# Altium project OBATS.PrjPcb
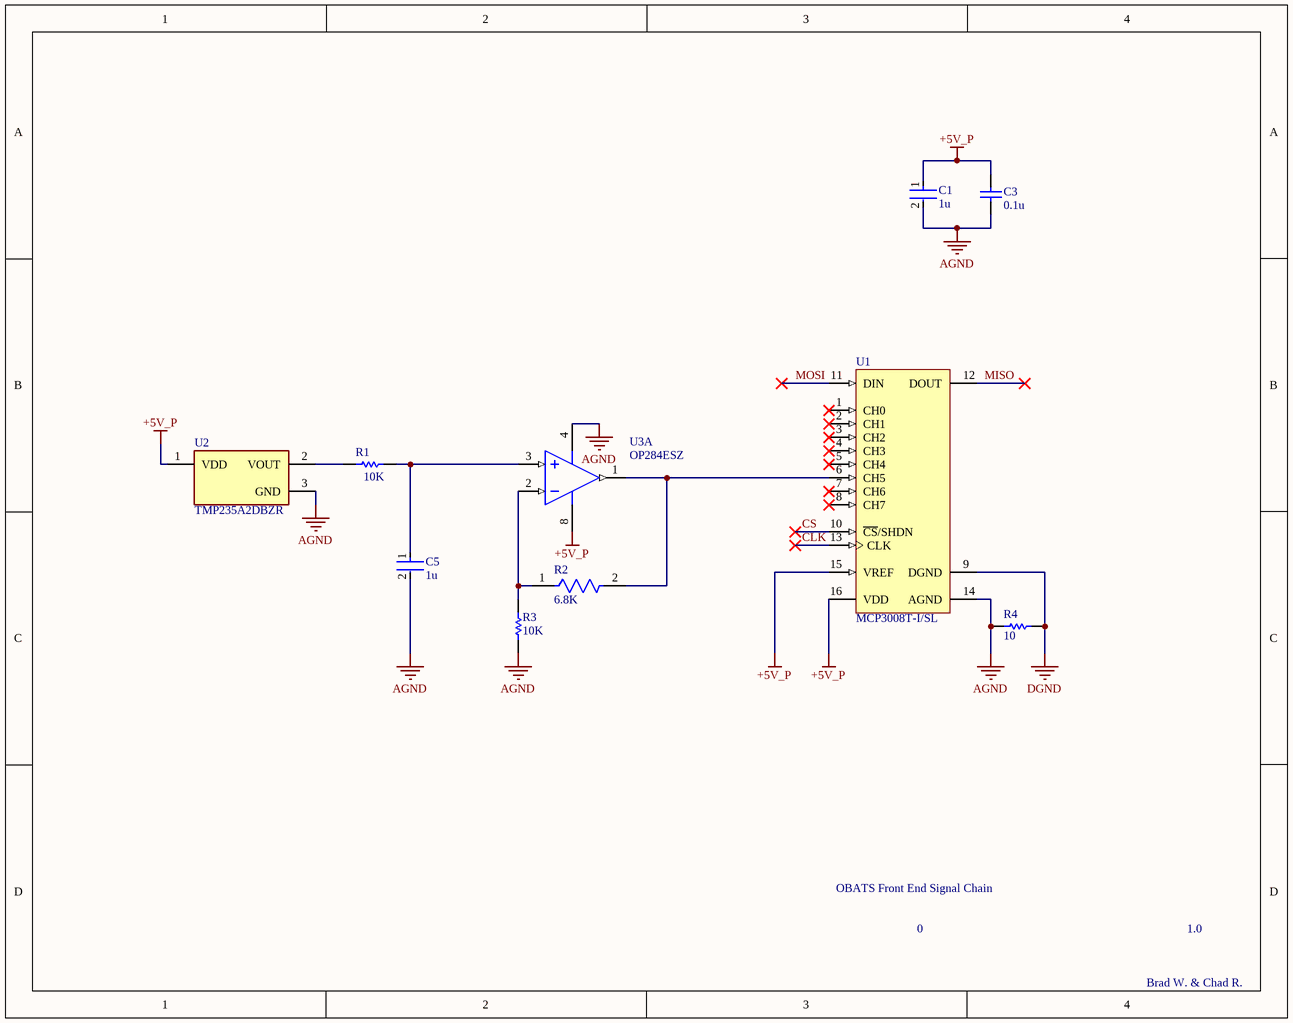
[diagram p0: tmp235_Front_End_Siognal_Chain.SchDoc]
1 sheet, 10 parts. Net scope: global (net labels, ports and power ports of the same name join across sheets).
Board file: tmp235_Front_End_Siognal_Chain.PcbDoc

## Sheet tmp235_Front_End_Siognal_Chain.SchDoc
size A

### Parts
C1  1u  [FP-CL31-IPC_B]
C3  0.1u  [CAPC1206(3216)130_M]
C5  1u  [FP-CL31-IPC_B]
R1  10K  [RESC3116X65X45ML10T20]
R2  6.8K  [FP-AC1206-MFG]
R3  10K  [RESC3116X65X45ML10T20]
R4  10  [RESC3216X60X45ML10T20]
U1  MCP3008T-I/SL  [SOIC-SL16_N]
U2  TMP235A2DBZR  [FP-DBZ0003A-MFG]
U3  OP284ESZ  [ADI-R-8_L]  (part A of 2)

### Nets
+5V_P: C1.1 C3.2 U1.15(VREF) U1.16(VDD) U2.1(VDD) U3.8(+V)
AGND: C1.2 C3.1 C5.2 R3.1 R4.1 U1.14(AGND) U2.3(GND) U3.4(-V)
DGND: R4.2 U1.9(DGND)
CLK: U1.13(CLK)
CS: U1.10(~{CS}/SHDN)
MISO: U1.12(DOUT)
MOSI: U1.11(DIN)
NetC5_1: C5.1 R1.2 U3.3(+IN_A)
NetR1_1: R1.1 U2.2(VOUT)
NetR2_1: R2.1 R3.2 U3.2(-IN_A)
NetR2_2: R2.2 U1.6(CH5) U3.1(OUT_A)

Not connected (* = marked no-connect by the designer): U1 1(CH0)* 2(CH1)* 3(CH2)* 4(CH3)* 5(CH4)* 7(CH6)* 8(CH7)*

### Notes on the sheet
- OBATS Front End Signal Chain
- 0
- 1.0
- Brad W. & Chad R.

### Library data of the parts
C1 C5 = CMP-13271-001662-1: Cap Ceramic 1uF 50V X7R ±10% SMD 1206 +125°C Embossed T/R; Case Code (Metric): 3216; Packaging: Tape and Reel; Depth: 1.6mm; Max Operating Temperature: 125°C; Length: 3.2mm; Contact Plating: Tin; Voltage Rating (DC): 50V; Radiation Hardening: No; Min Operating Temperature: -55°C; Dielectric: X7R; Voltage: 50V; Lead Free: Lead Free; Capacitance: 1uF; Package Quantity: 1; Material: Ceramic; Thickness: 0.071inch; Width: 0.063inch; Voltage Rating: 50V; Case Code (Imperial): 1206; Mount: Surface Mount; Case/Package: 1206; Tolerance: 10%; Height: 1.6mm
C3 = CMP-1037-04215-1: CAP 100nF 100V ±20% 1206 (3216 Metric) Thickness 1.3mm SMD; Case-EIA: 1206; Tolerance: Â±20%; Case-Metric: 3216; Rated Voltage: 100 V; Max Thickness: 1.3 mm; Technology: SMT; Value: 100nF
R1 R3 = CMP-2003-04910-1: Manufacturer: Yageo; Part Number: AC1206FR-0710KL
R2 = CMP-03412-003637-1: RES SMD 6.8K OHM 1% 1/4W 1206; Manufacturer Part Number: AC1206FR-076K8L; Manufacturer: Yageo; Automotive Grade: Grade 0; Power Rating: 0.25W; Voltage Rating: 200V; Value: 6.8KΩ; Tolerance: 0.01; Device Class L3: Chip SMD Resistors; Composition: Thick Film; ComponentLink2Description: Datasheet; Temperature: -55°C to +155°C; ComponentLink2URL: http://www.yageo.com/NewPortal/yageodocoutput?fileName=/pdf/R-Chip/PYu-AC_51_RoHS_L_6.pdf; Mouser Description: Thick Film Resistors - SMD 1/4W 6.8K ohm 1% AEC-Q200; Series: AC; Temperature Range High: +155°C; Octopart: https://octopart.com/ac1206fr-076k8l-yageo-26041203; Category: Res; Lead Free: Yes; Resistance: 6.8KΩ; Package: AC1206; Height: 0.65mm; Automotive: Yes; Ipc Land Pattern Name: RESC310160X55; RoHS: TRUE; Device Class L2: Resistors; Device Class L1: Passive Components; Temperature Range Low: -55°C; Footprint Url: http://www.yageo.com/exep/pages/download/literatures/PYu-R_Mount_10.pdf; Digikey Description: RES SMD 6.8K OHM 1% 1/4W 1206
R4 = CMP-2003-04815-1: Manufacturer: Vishay Dale; Part Number: CRCW120610R0FKEA
U1 = CMP-0188-00351-2: 2.7V 4-Channel/8-Channel 10-Bit A/D Converters with SPI Serial Interface, 16-Pin SOIC 150mil, Industrial Temperature, Tape and Reel; ComponentLink2Description: Datasheet; Code_JEDEC: MS-012-AC; Code_IPC: SOIC127P600-16; ComponentLink1Description: Manufacturer URL; DatasheetVersion: revD, Dec-2008; PackageReference: SOIC-SL16; ComponentLink2URL: http://ww1.microchip.com/downloads/en/DeviceDoc/21295d.pdf; ComponentLink3Description: Package Specification; ComponentLink3URL: http://www.microchip.com/stellent/groups/techpub_sg/documents/packagingspec/en012702.pdf; PackageVersion: revBB, Aug-2009; RevisionNote: URLs added.; PackageDescription: 16-Lead Plastic Small Outline (SL) - Narrow, 3.90mm Body [SOIC]; ComponentLink1URL: http://www.microchip.com/
U2 = CMP-04948-000003-1: LOW-POWER HIGH-ACCURACY ANALOG O; Manufacturer: Texas Instruments; Output Current: 500uA; Operating Supply Current: 9uA; Max Supply Voltage: 5.5V; Max Junction Temp: +150°C; Accuracy: 0.5%; Min Supply Voltage: 2.3V; Standoff Height: 0.01mm; Sensor Output: Analog Voltage; Ambient Temperature Range Low: -40°C; Device Class L2: Temperature and Humidity Sensors; Digikey Description: LOW-POWER HIGH-ACCURACY ANALOG O; Lead Free: Yes; Category: IC; Device Class L3: unset; Temperature Range Low: -40°C; Manufacturer Part Number: TMP235A2DBZR; ComponentLink2Description: Datasheet; Package: DBZ0003A; Octopart: https://octopart.com/tmp235a2dbzr-texas+instruments-94966376; Device Class L1: Sensors; Temperature Range High: +150°C; Height: 1.12mm; Temperature: -40°C to +150°C; RoHS: TRUE; Ambient Temperature Range High: +150°C; Automotive: No; ComponentLink2URL: http://www.ti.com/lit/ds/symlink/tmp235.pdf; Mouser Description: ±2°C Analog output temperature sensor, with 10mV /°C gain 3-SOT-23 -40 to 150
U3 = CMP-0384-00701-1: Double Channel Single-Supply Operation Operational Amplifier, 4.25 MHz BW, 4 V/us SR, Industrial, 8-pin SOIC (R-8), Tube; Generic Part Number: OP284; Manufacturer: Analog Devices; Slew Rate: 4V/us; Amplifiers Per Package: 2; Input Offset Voltage: 175uV; V Span Max: 36V; Iq/Amp: 2mA; V Span Min: 3V; Input Bias Current: 80nA; ComponentLink1URL: http://www.analog.com/en/index.html; PackageReference: R-8; Code_JEDEC: MS-012-AA; Small Signal Bandwidth: 4.25MHz; DatasheetVersion: Rev. J; PackageDescription: 8-Pin Standard Small Outline Package, Body 3.9 x 4.9 mm, Pitch 1.27 mm; ComponentLink3Description: Package Specification; PackageVersion: 060506-A; ComponentLink2Description: Datasheet; ComponentLink3URL: http://www.analog.com/static/imported-files/packages/PKG_PDF/SOIC_Narrow%20(R)/R_8.pdf; Mounting Technology: Surface Mount; ComponentLink2URL: http://www.analog.com/static/imported-files/data_sheets/OP184_284_484.pdf; PartNumber: OP284ESZ; ComponentLink1Description: Manufacturer URL